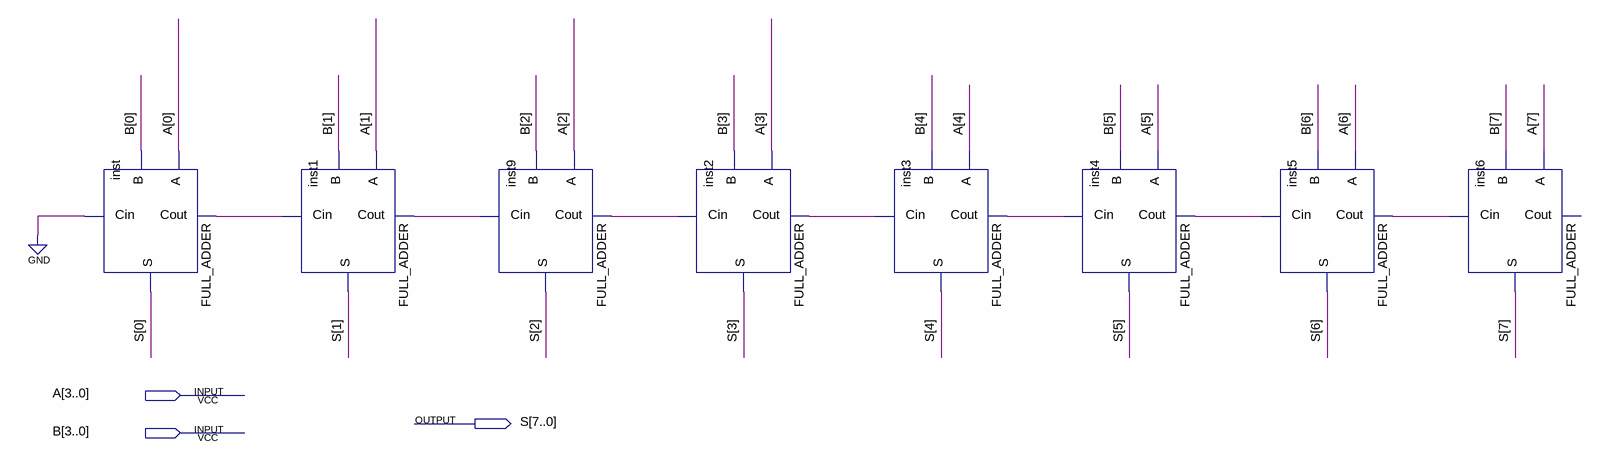
[diagram p0: schematic sheet]
// Quartus schematic Add4bit.bdf as structural Verilog: 8 symbols, 3 pins
module Add4bit (
  input  [7:0] A,
  input  [7:0] B,
  output [7:0] S
);

  wire inst1_cout, inst2_cout, inst3_cout, inst4_cout, inst5_cout, inst9_cout, inst_cout;

  FULL_ADDER inst (.A(A[0]), .B(B[0]), .Cin(1'b0), .S(S[0]), .Cout(inst_cout));
  FULL_ADDER inst1 (.A(A[1]), .B(B[1]), .Cin(inst_cout), .S(S[1]), .Cout(inst1_cout));
  FULL_ADDER inst9 (.A(A[2]), .B(B[2]), .Cin(inst1_cout), .S(S[2]), .Cout(inst9_cout));
  FULL_ADDER inst2 (.A(A[3]), .B(B[3]), .Cin(inst9_cout), .S(S[3]), .Cout(inst2_cout));
  FULL_ADDER inst3 (.A(A[4]), .B(B[4]), .Cin(inst2_cout), .S(S[4]), .Cout(inst3_cout));
  FULL_ADDER inst4 (.A(A[5]), .B(B[5]), .Cin(inst3_cout), .S(S[5]), .Cout(inst4_cout));
  FULL_ADDER inst5 (.A(A[6]), .B(B[6]), .Cin(inst4_cout), .S(S[6]), .Cout(inst5_cout));
  FULL_ADDER inst6 (.A(A[7]), .B(B[7]), .Cin(inst5_cout), .S(S[7]));  // open: Cout
endmodule
